# Altium schematic sheet STM32F4.SchDoc
size A3
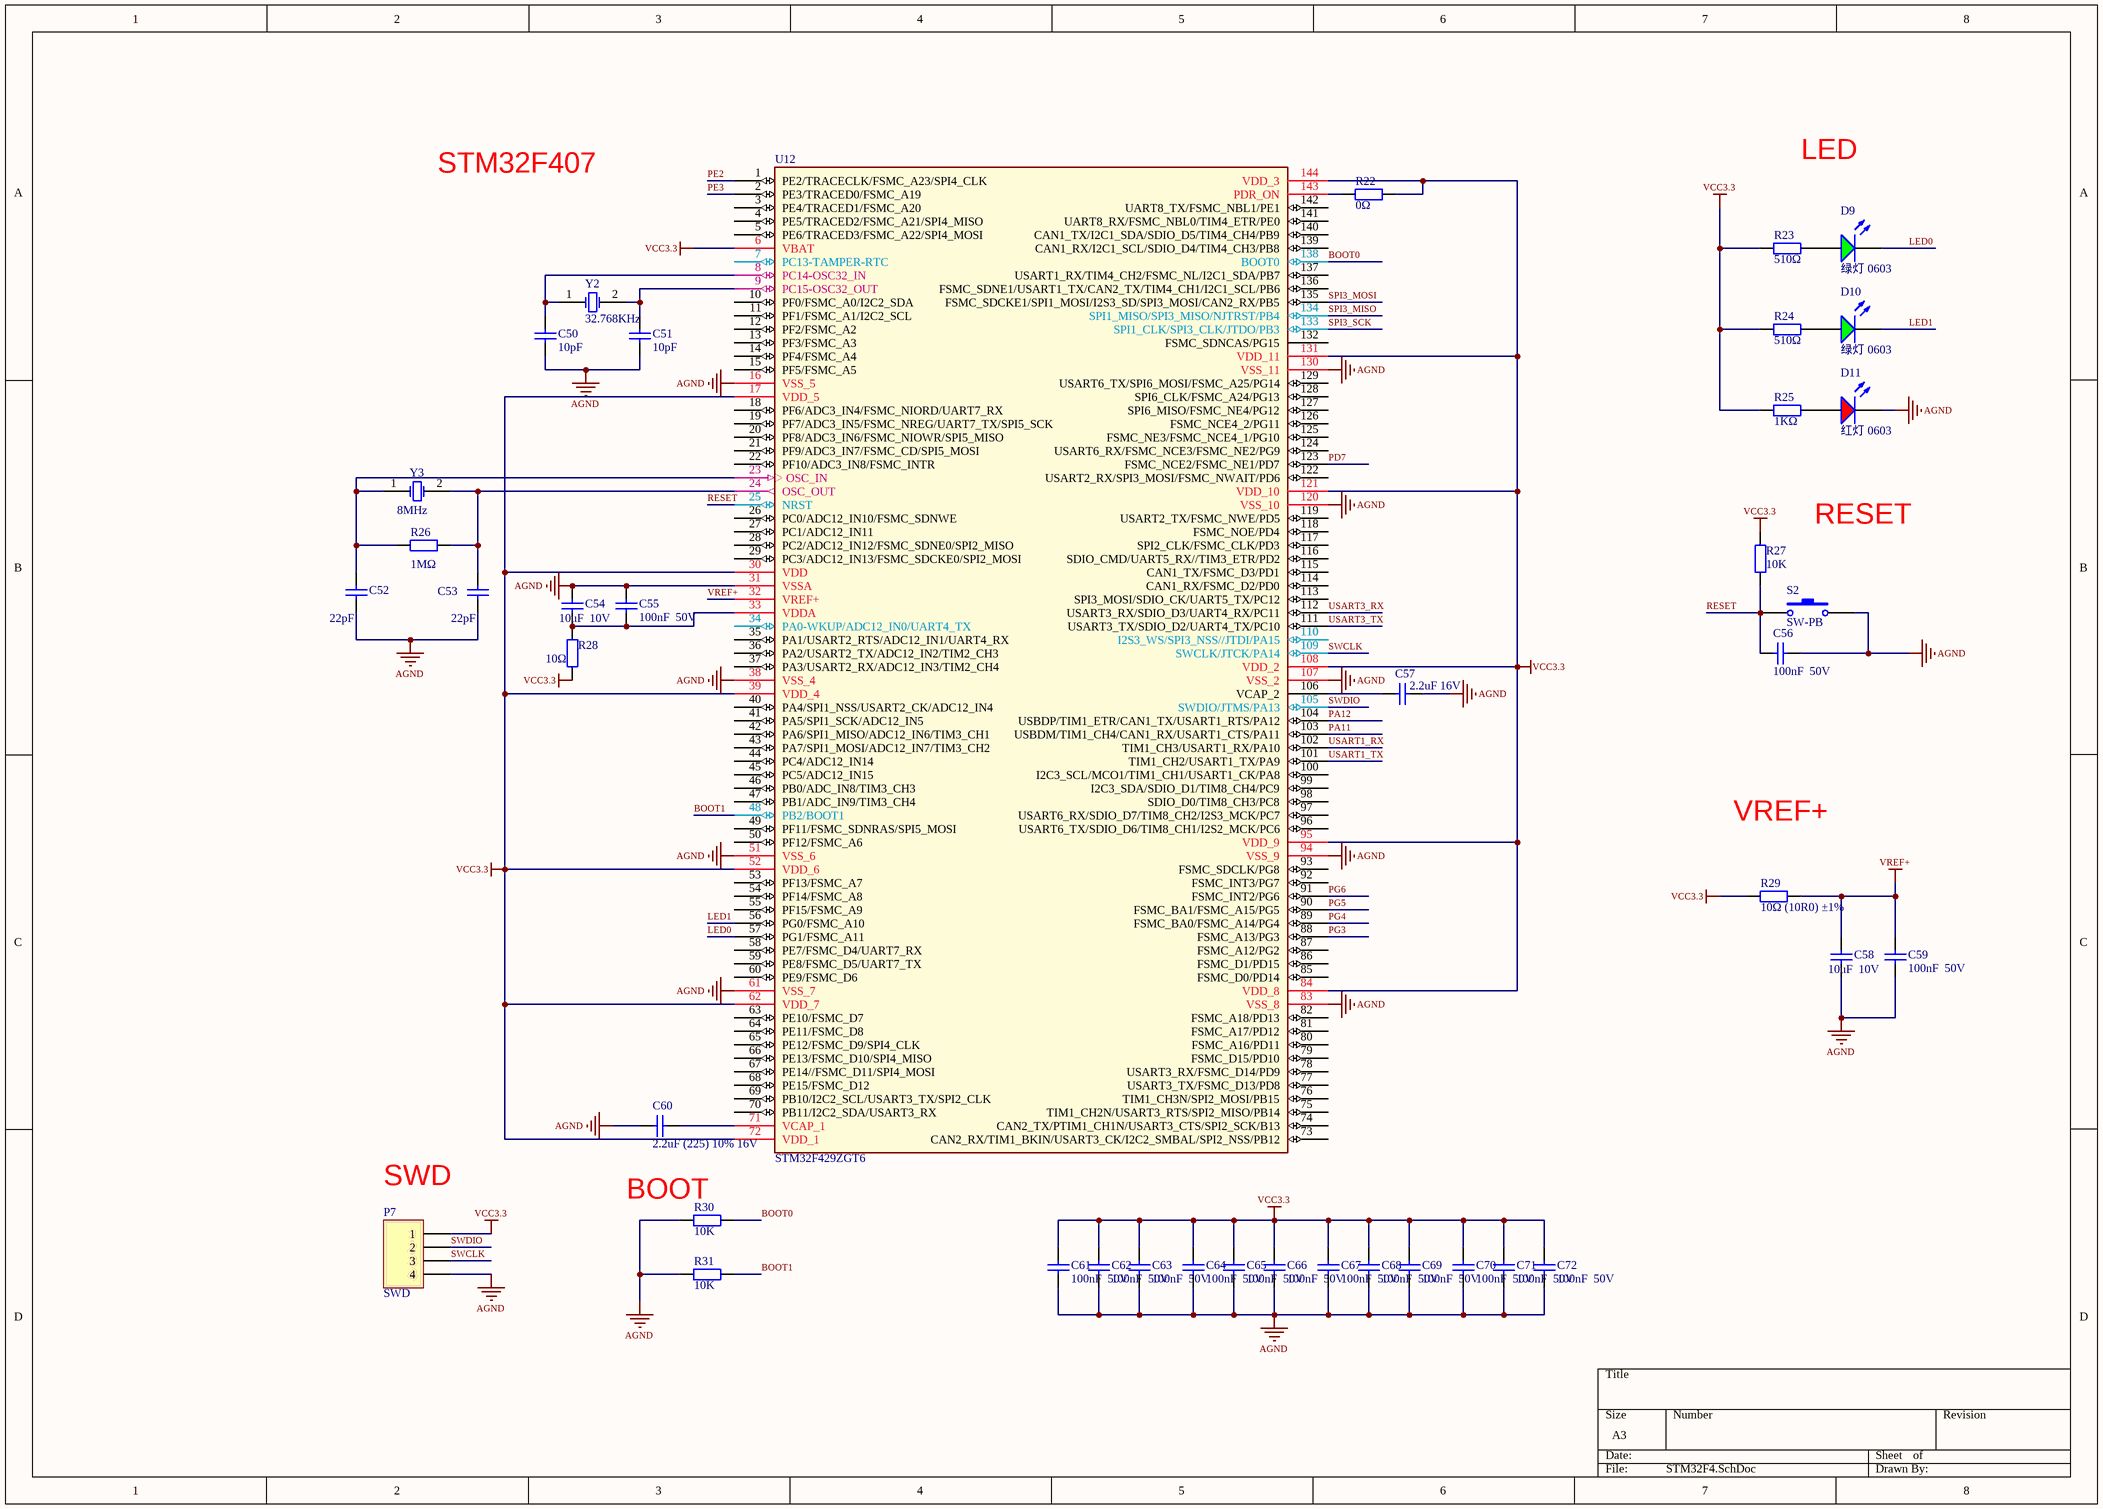
[diagram p0: STM32F4.SchDoc]

## Parts
C50  10pF  [0402_C]
C51  10pF  [0402_C]
C52  22pF  [0402_C]
C53  22pF  [0402_C]
C54  10uF  10V  [0402_C]
C55  100nF  50V  [0402_C]
C56  100nF  50V  [0402_C]
C57  2.2uF 16V  [0603_C]
C58  10uF  10V  [0402_C]
C59  100nF  50V  [0402_C]
C60  2.2uF (225) 10% 16V  [0603_C]
C61  100nF  50V  [0402_C]
C62  100nF  50V  [0402_C]
C63  100nF  50V  [0402_C]
C64  100nF  50V  [0402_C]
C65  100nF  50V  [0402_C]
C66  100nF  50V  [0402_C]
C67  100nF  50V  [0402_C]
C68  100nF  50V  [0402_C]
C69  100nF  50V  [0402_C]
C70  100nF  50V  [0402_C]
C71  100nF  50V  [0402_C]
C72  100nF  50V  [0402_C]
D9  绿灯 0603  [0603_LED_S1]
D10  绿灯 0603  [0603_LED_S1]
D11  红灯 0603  [0603_LED_S1]
P7  SWD  [HDR1X4]
R22  0Ω  [0402_R]
R23  510Ω  [0402_R]
R24  510Ω  [0402_R]
R25  1KΩ  [0402_R]
R26  1MΩ  [0402_R]
R27  10K  [0402_R]
R28  10Ω  [0402_R]
R29  10Ω (10R0) ±1%  [0402_R]
R30  10K  [0402_R]
R31  10K  [0402_R]
S2  SW-PB  [key_4.5*4.5*3.8]
U12  STM32F429ZGT6  [LQFP-144_20x20x05P]
Y2  32.768KHz  [SMD-3215_2P FC - 135]
Y3  8MHz  [SMD-5032_2P]

## Nets
AGND: C50.1 C51.1 C52.1 C53.1 C54.2 C55.2 C56.1 C57.1 C58.1 C59.1 C60.1 C61.1 C62.1 C63.1 C64.1 C65.1 C66.1 C67.1 C68.1 C69.1 C70.1 C71.1 C72.1 D11.K P7.4 R30.1 R31.1 S2.2 U12.16(VSS_5) U12.31(VSSA) U12.38(VSS_4) U12.51(VSS_6) U12.61(VSS_7) U12.83(VSS_8) U12.94(VSS_9) U12.107(VSS_2) U12.120(VSS_10) U12.130(VSS_11)
VCC3.3: C61.2 C62.2 C63.2 C64.2 C65.2 C66.2 C67.2 C68.2 C69.2 C70.2 C71.2 C72.2 P7.1 R22.1 R23.1 R24.1 R25.1 R27.1 R28.1 R29.2 U12.6(VBAT) U12.17(VDD_5) U12.30(VDD) U12.39(VDD_4) U12.52(VDD_6) U12.62(VDD_7) U12.72(VDD_1) U12.84(VDD_8) U12.95(VDD_9) U12.108(VDD_2) U12.121(VDD_10) U12.131(VDD_11) U12.144(VDD_3)
VREF+: C58.2 C59.2 R29.1 U12.32(VREF+)
BOOT0: R30.2 U12.138(BOOT0)
BOOT1: R31.2 U12.48(PB2/BOOT1)
LED0: D9.K U12.57(PG1/FSMC_A11)
LED1: D10.K U12.56(PG0/FSMC_A10)
PA11: U12.103(USBDM/TIM1_CH4/CAN1_RX/USART1_CTS/PA11)
PA12: U12.104(USBDP/TIM1_ETR/CAN1_TX/USART1_RTS/PA12)
PD7: U12.123(FSMC_NCE2/FSMC_NE1/PD7)
PE2: U12.1(PE2/TRACECLK/FSMC_A23/SPI4_CLK)
PE3: U12.2(PE3/TRACED0/FSMC_A19)
PG3: U12.88(FSMC_A13/PG3)
PG4: U12.89(FSMC_BA0/FSMC_A14/PG4)
PG5: U12.90(FSMC_BA1/FSMC_A15/PG5)
PG6: U12.91(FSMC_INT2/PG6)
RESET: C56.2 R27.2 S2.1 U12.25(NRST)
SPI3_MISO: U12.134(SPI1_MISO/SPI3_MISO/NJTRST/PB4)
SPI3_MOSI: U12.135(FSMC_SDCKE1/SPI1_MOSI/I2S3_SD/SPI3_MOSI/CAN2_RX/PB5)
SPI3_SCK: U12.133(SPI1_CLK/SPI3_CLK/JTDO/PB3)
SWCLK: P7.3 U12.109(SWCLK/JTCK/PA14)
SWDIO: P7.2 U12.105(SWDIO/JTMS/PA13)
USART1_RX: U12.102(TIM1_CH3/USART1_RX/PA10)
USART1_TX: U12.101(TIM1_CH2/USART1_TX/PA9)
USART3_RX: U12.112(USART3_RX/SDIO_D3/UART4_RX/PC11)
USART3_TX: U12.111(USART3_TX/SDIO_D2/UART4_TX/PC10)
NetC50_2: C50.2 U12.8(PC14-OSC32_IN) Y2.1(OSC1)
NetC51_2: C51.2 U12.9(PC15-OSC32_OUT) Y2.2(OSC2)
NetC52_2: C52.2 R26.1 U12.23(OSC_IN) Y3.1(OSC1)
NetC53_2: C53.2 R26.2 U12.24(OSC_OUT) Y3.2(OSC2)
NetC54_1: C54.1 C55.1 R28.2 U12.33(VDDA)
NetC57_2: C57.2 U12.106(VCAP_2)
NetC60_2: C60.2 U12.71(VCAP_1)
NetD9_A: D9.A R23.2
NetD10_A: D10.A R24.2
NetD11_A: D11.A R25.2
NetR22_2: R22.2 U12.143(PDR_ON)

Not connected (* = marked no-connect by the designer): U12 3(PE4/TRACED1/FSMC_A20) 4(PE5/TRACED2/FSMC_A21/SPI4_MISO) 5(PE6/TRACED3/FSMC_A22/SPI4_MOSI) 7(PC13-TAMPER-RTC) 10(PF0/FSMC_A0/I2C2_SDA) 11(PF1/FSMC_A1/I2C2_SCL) 12(PF2/FSMC_A2) 13(PF3/FSMC_A3) 14(PF4/FSMC_A4) 15(PF5/FSMC_A5) 18(PF6/ADC3_IN4/FSMC_NIORD/UART7_RX) 19(PF7/ADC3_IN5/FSMC_NREG/UART7_TX/SPI5_SCK) 20(PF8/ADC3_IN6/FSMC_NIOWR/SPI5_MISO) 21(PF9/ADC3_IN7/FSMC_CD/SPI5_MOSI) 22(PF10/ADC3_IN8/FSMC_INTR) 26(PC0/ADC12_IN10/FSMC_SDNWE) 27(PC1/ADC12_IN11) 28(PC2/ADC12_IN12/FSMC_SDNE0/SPI2_MISO) 29(PC3/ADC12_IN13/FSMC_SDCKE0/SPI2_MOSI) 34(PA0-WKUP/ADC12_IN0/UART4_TX) 35(PA1/USART2_RTS/ADC12_IN1/UART4_RX) 36(PA2/USART2_TX/ADC12_IN2/TIM2_CH3) 37(PA3/USART2_RX/ADC12_IN3/TIM2_CH4) 40(PA4/SPI1_NSS/USART2_CK/ADC12_IN4) 41(PA5/SPI1_SCK/ADC12_IN5) 42(PA6/SPI1_MISO/ADC12_IN6/TIM3_CH1) 43(PA7/SPI1_MOSI/ADC12_IN7/TIM3_CH2) 44(PC4/ADC12_IN14) 45(PC5/ADC12_IN15) 46(PB0/ADC_IN8/TIM3_CH3) 47(PB1/ADC_IN9/TIM3_CH4) 49(PF11/FSMC_SDNRAS/SPI5_MOSI) 50(PF12/FSMC_A6) 53(PF13/FSMC_A7) 54(PF14/FSMC_A8) 55(PF15/FSMC_A9) 58(PE7/FSMC_D4/UART7_RX) 59(PE8/FSMC_D5/UART7_TX) 60(PE9/FSMC_D6) 63(PE10/FSMC_D7) 64(PE11/FSMC_D8) 65(PE12/FSMC_D9/SPI4_CLK) 66(PE13/FSMC_D10/SPI4_MISO) 67(PE14//FSMC_D11/SPI4_MOSI) 68(PE15/FSMC_D12) 69(PB10/I2C2_SCL/USART3_TX/SPI2_CLK) 70(PB11/I2C2_SDA/USART3_RX) 73(CAN2_RX/TIM1_BKIN/USART3_CK/I2C2_SMBAL/SPI2_NSS/PB12) 74(CAN2_TX/PTIM1_CH1N/USART3_CTS/SPI2_SCK/B13) 75(TIM1_CH2N/USART3_RTS/SPI2_MISO/PB14) 76(TIM1_CH3N/SPI2_MOSI/PB15) 77(USART3_TX/FSMC_D13/PD8) 78(USART3_RX/FSMC_D14/PD9) 79(FSMC_D15/PD10) 80(FSMC_A16/PD11) 81(FSMC_A17/PD12) 82(FSMC_A18/PD13) 85(FSMC_D0/PD14) 86(FSMC_D1/PD15) 87(FSMC_A12/PG2) 92(FSMC_INT3/PG7) 93(FSMC_SDCLK/PG8) 96(USART6_TX/SDIO_D6/TIM8_CH1/I2S2_MCK/PC6) 97(USART6_RX/SDIO_D7/TIM8_CH2/I2S3_MCK/PC7) 98(SDIO_D0/TIM8_CH3/PC8) 99(I2C3_SDA/SDIO_D1/TIM8_CH4/PC9) 100(I2C3_SCL/MCO1/TIM1_CH1/USART1_CK/PA8) 110(I2S3_WS/SPI3_NSS//JTDI/PA15) 113(SPI3_MOSI/SDIO_CK/UART5_TX/PC12) 114(CAN1_RX/FSMC_D2/PD0) 115(CAN1_TX/FSMC_D3/PD1) 116(SDIO_CMD/UART5_RX//TIM3_ETR/PD2) 117(SPI2_CLK/FSMC_CLK/PD3) 118(FSMC_NOE/PD4) 119(USART2_TX/FSMC_NWE/PD5) 122(USART2_RX/SPI3_MOSI/FSMC_NWAIT/PD6) 124(USART6_RX/FSMC_NCE3/FSMC_NE2/PG9) 125(FSMC_NE3/FSMC_NCE4_1/PG10) 126(FSMC_NCE4_2/PG11) 127(SPI6_MISO/FSMC_NE4/PG12) 128(SPI6_CLK/FSMC_A24/PG13) 129(USART6_TX/SPI6_MOSI/FSMC_A25/PG14) 132(FSMC_SDNCAS/PG15) 136(FSMC_SDNE1/USART1_TX/CAN2_TX/TIM4_CH1/I2C1_SCL/PB6) 137(USART1_RX/TIM4_CH2/FSMC_NL/I2C1_SDA/PB7) 139(CAN1_RX/I2C1_SCL/SDIO_D4/TIM4_CH3/PB8) 140(CAN1_TX/I2C1_SDA/SDIO_D5/TIM4_CH4/PB9) 141(UART8_RX/FSMC_NBL0/TIM4_ETR/PE0) 142(UART8_TX/FSMC_NBL1/PE1)

## Notes on the sheet
- STM32F407
- LED
- RESET
- VREF+
- (near P7) SWD
- (near R30) BOOT

## Library data of the parts
C50 C51 = 0603 10pF (100) 5% 50V: 贴片电容; ComponentLink1Description: 供应商链接; ComponentLink1URL: http://www.szlcsc.com/product/details_1986.html; Package: 0603; Supplier: LC; SuppliersPartNumber: C1634
C52 C53 = 0603 22pF (220) 5% 50V: 贴片电容; ComponentLink1Description: 供应商链接; ComponentLink1URL: http://www.szlcsc.com/product/details_2005.html; Package: 0603; Supplier: LC; SuppliersPartNumber: C1653
C54 C58 = 0603 10uF (106) 10% 10V: 贴片电容; ComponentLink1Description: 供应商链接; ComponentLink1URL: http://www.szlcsc.com/product/details_20411.html; Package: 0603; Supplier: LC; SuppliersPartNumber: C19702
C55 C56 C59 C61-C72 = 0603 100nF (104) 10% 50V: 贴片电容; ComponentLink1Description: 供应商链接; ComponentLink1URL: http://www.szlcsc.com/product/details_15331.html; Package: 0603; Supplier: LC; SuppliersPartNumber: C14663
C57 C60 = 0603 2.2uF (225) 10% 16V: 贴片电容; ComponentLink1Description: 供应商链接; ComponentLink1URL: http://www.szlcsc.com/product/details_24366.html; Package: 0603; Supplier: LC; SuppliersPartNumber: C23630
D9 D10 = 0603 绿灯: 发光二极管; ComponentLink1Description: 供应商链接; ComponentLink1URL: http://www.szlcsc.com/product/details_73152.html; Package: 0603; Supplier: LC; SuppliersPartNumber: C72043
D11 = 0603 红灯: 发光二极管; ComponentLink1Description: 供应商链接; ComponentLink1URL: http://www.szlcsc.com/product/details_2659.html; Package: 0603; Supplier: LC; SuppliersPartNumber: C2286
P7 = Header 4: Header, 4-Pin; LatestRevisionDate: 17-Jul-2002; LatestRevisionNote: Re-released for DXP Platform.; Publisher: Altium Limited
R22 = 0603 0Ω (0R0) 1%: 贴片电阻; ComponentLink1Description: 供应商链接; ComponentLink1URL: http://www.szlcsc.com/product/details_21903.html; Package: 0603; Supplier: LC; SuppliersPartNumber: C21189
R23 R24 = 0603 510Ω (5100) 1%: 贴片电阻; ComponentLink1Description: 供应商链接; ComponentLink1URL: http://www.szlcsc.com/product/details_23920.html; Package: 0603; Supplier: LC; SuppliersPartNumber: C23193
R25 = 0603 1KΩ (1001) 1%: 贴片电阻; ComponentLink1Description: 供应商链接; ComponentLink1URL: http://www.szlcsc.com/product/details_21904.html; Package: 0603; Supplier: LC; SuppliersPartNumber: C21190
R26 = 0603 1.2MΩ (1204) 1%: 贴片电阻; ComponentLink1Description: 供应商链接; ComponentLink1URL: http://www.szlcsc.com/product/details_23493.html; Package: 0603; Supplier: LC; SuppliersPartNumber: C22766
R27-R31 = 0603 10Ω (10R0) 1%: 贴片电阻; ComponentLink1Description: 供应商链接; ComponentLink1URL: http://www.szlcsc.com/product/details_23586.html; Package: 0603; Supplier: LC; SuppliersPartNumber: C22859
S2 = SW-PB: Switch; Published: 24-Mar-1999; LatestRevisionDate: 17-Jul-2002; LatestRevisionNote: Re-released for DXP Platform.; PackageReference: SPST-2; Publisher: Altium Limited; PackageDescription: Switch; 2 Leads
U12 = STM32F429ZGT6: ARM; ComponentLink1Description: 供应商链接; ComponentLink1URL: http://www.szlcsc.com/product/details_47529.html; Package: LQFP-144_20x20x05P; Supplier: LC; SuppliersPartNumber: C46525
Y2 = SMD-3215_2P 32.768KHz 20ppm 12.5pF: 贴片晶振; ComponentLink1Description: 供应商链接; ComponentLink1URL: http://www.szlcsc.com/product/details_33310.html; Package: SMD-3215_2P; Supplier: LC; SuppliersPartNumber: C32346
Y3 = SMD-5032_2P 8MHz 20ppm 20pF: 贴片晶振; ComponentLink1Description: 供应商链接; ComponentLink1URL: http://www.szlcsc.com/product/details_117214.html; Package: SMD-5032_2P; Supplier: LC; SuppliersPartNumber: C115962